# EAGLE design eco-pulser (EAGLE 9.4.1)
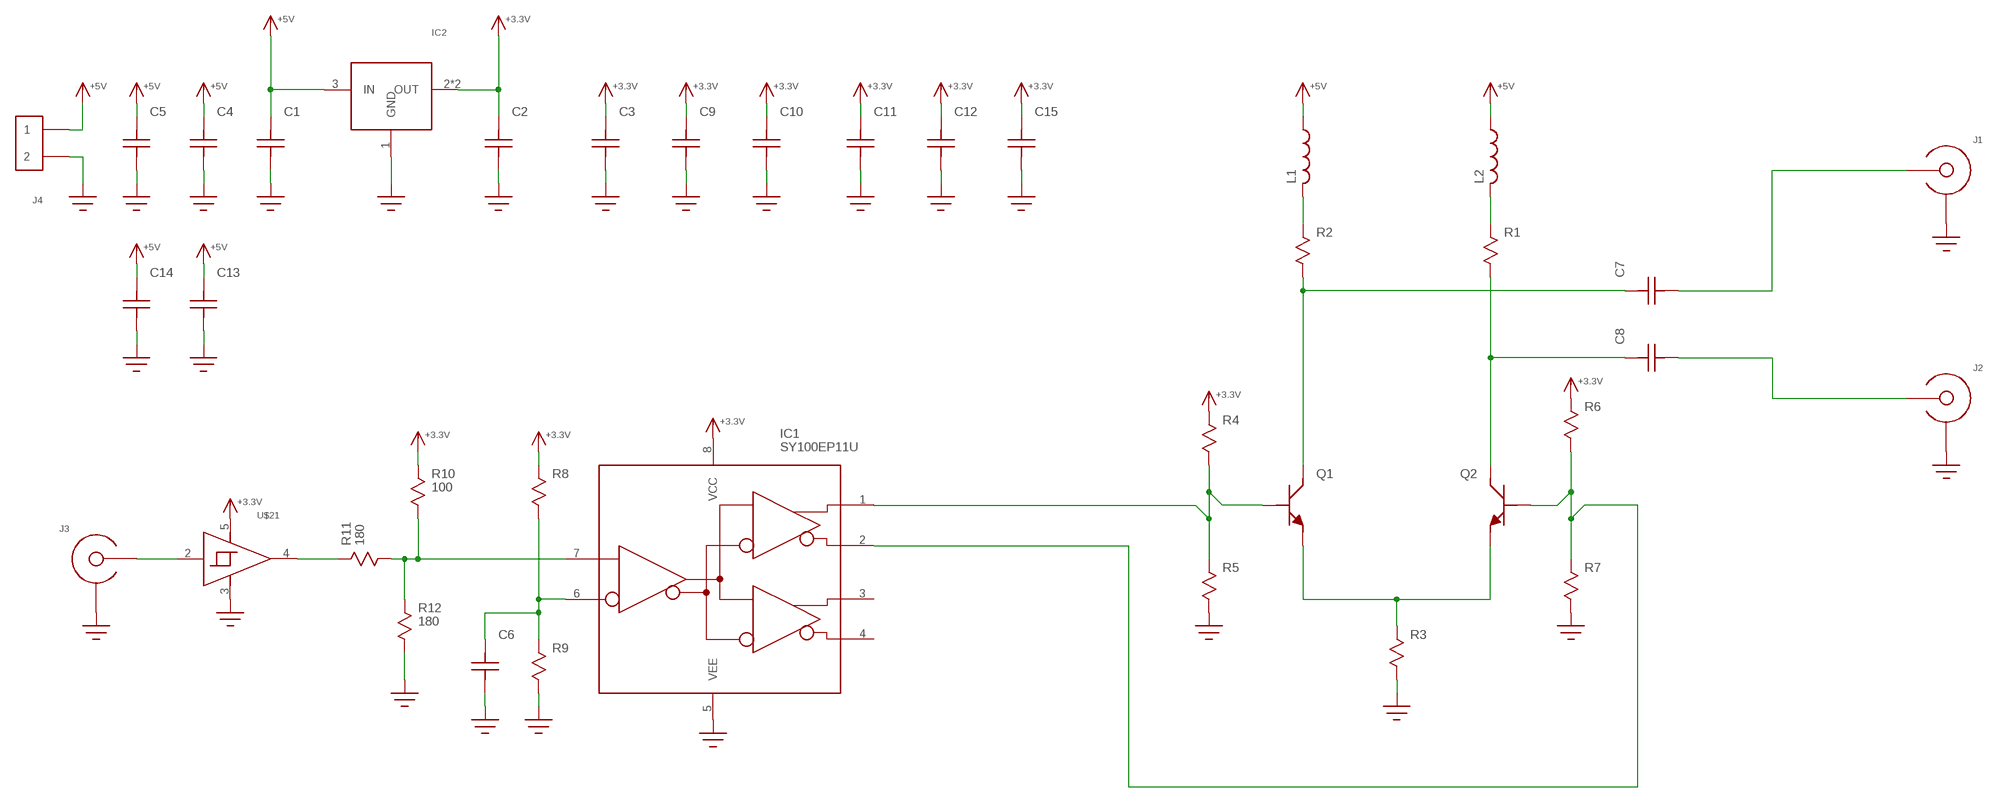
[diagram p0: schematic, sheet 1]

## Parts
C1  C1206  [1206]
C2  C1206  [1206]
C3  C0603  [C0603]
C4  C0603  [C0603]
C5  C0603  [C0603]
C6  C0603  [C0603]
C7  C0603  [C0603]
C8  C0603  [C0603]
C9  C0603  [C0603]
C10  C0603  [C0603]
C11  C0603  [C0603]
C12  C0603  [C0603]
C13  C0603  [C0603]
C14  C0603  [C0603]
C15  C0603  [C0603]
IC1  SY100EP11U  SY10EP11U  [SOIC8]
IC2  AZ1117E  [SOT-223]
J1  SMA_END_LAUNCH4L  [SMA_EDGE_LAUNCH]
J2  SMA_END_LAUNCH4L  [SMA_EDGE_LAUNCH]
J3  SMA_END_LAUNCH4L  [SMA_EDGE_LAUNCH]
J4  HEADER_2PIN  [HEADER_2PIN]
L1  INDUCTOR  [R0603]
L2  INDUCTOR  [R0603]
Q1  NPN-BFP740  [SOT343]
Q2  NPN-BFP740  [SOT343]
R1  R0603  [R0603]
R2  R0603  [R0603]
R3  R0603  [R0603]
R4  R0603  [R0603]
R5  R0603  [R0603]
R6  R0603  [R0603]
R7  R0603  [R0603]
R8  R0603  [R0603]
R9  R0603  [R0603]
R10  100  R0603  [R0603]
R11  180  R0603  [R0603]
R12  180  R0603  [R0603]
U$21  74LVC1G17  [SOT23-5]

## Nets
+3.3V: C2.P$2 C3.P$2 C9.P$2 C10.P$2 C11.P$2 C12.P$2 C15.P$2 IC1.8(VCC) IC2.2(OUT) IC2.4(OUT) R4.P$1 R6.P$1 R8.P$1 R10.P$1 U$21.5(VCC)
+5V: C1.P$2 C4.P$2 C5.P$2 C13.P$2 C14.P$2 IC2.3(IN) J4.1 L1.P$1 L2.P$1
GND: C1.P$1 C2.P$1 C3.P$1 C4.P$1 C5.P$1 C6.P$1 C9.P$1 C10.P$1 C11.P$1 C12.P$1 C13.P$1 C14.P$1 C15.P$1 IC1.5(VEE) IC2.1(GND) J1.BOTTOM_PAD(SHIELD) J1.GND@1(SHIELD) J1.GND@2(SHIELD) J1.GND@3(SHIELD) J1.GND@4(SHIELD) J1.GND@5(SHIELD) J1.GND@6(SHIELD) J1.GND@7(SHIELD) J1.GND@8(SHIELD) J1.GND@14(SHIELD) J1.GND@15(SHIELD) J1.GND@16(SHIELD) J1.GND@17(SHIELD) J1.GND_PAD1(SHIELD) J1.GND_PAD2(SHIELD) J2.BOTTOM_PAD(SHIELD) J2.GND@1(SHIELD) J2.GND@2(SHIELD) J2.GND@3(SHIELD) J2.GND@4(SHIELD) J2.GND@5(SHIELD) J2.GND@6(SHIELD) J2.GND@7(SHIELD) J2.GND@8(SHIELD) J2.GND@14(SHIELD) J2.GND@15(SHIELD) J2.GND@16(SHIELD) J2.GND@17(SHIELD) J2.GND_PAD1(SHIELD) J2.GND_PAD2(SHIELD) J3.BOTTOM_PAD(SHIELD) J3.GND@1(SHIELD) J3.GND@2(SHIELD) J3.GND@3(SHIELD) J3.GND@4(SHIELD) J3.GND@5(SHIELD) J3.GND@6(SHIELD) J3.GND@7(SHIELD) J3.GND@8(SHIELD) J3.GND@14(SHIELD) J3.GND@15(SHIELD) J3.GND@16(SHIELD) J3.GND@17(SHIELD) J3.GND_PAD1(SHIELD) J3.GND_PAD2(SHIELD) J4.2 R3.P$2 R5.P$2 R7.P$2 R9.P$2 R12.P$2 U$21.3(GND)
N$1: L1.P$2 R2.P$1
N$2: L2.P$2 R1.P$1
N$3: C7.P$2 Q1.3(C) R2.P$2
N$4: C8.P$2 Q2.3(C) R1.P$2
N$5: Q1.2(E) Q1.4(E) Q2.2(E) Q2.4(E) R3.P$1
N$6: IC1.1(Q0) Q1.1(B) R4.P$2 R5.P$1
N$7: C6.P$2 IC1.6(!D!) R8.P$2 R9.P$1
N$8: IC1.2(!Q0!) Q2.1(B) R6.P$2 R7.P$1
N$9: R11.P$1 U$21.4(OUT)
N$10: IC1.7(D) R10.P$2 R11.P$2 R12.P$1
N$11: J3.CENTER@1(CENTER) J3.CENTER@2(CENTER) U$21.2(IN)
N$12: C7.P$1 J1.CENTER@1(CENTER) J1.CENTER@2(CENTER)
N$13: C8.P$1 J2.CENTER@1(CENTER) J2.CENTER@2(CENTER)
Unconnected: IC1.3(Q1) IC1.4(!Q1!)

## Library data of the parts
C1-C15 = yapo:C
IC1 = yapo:SY10EP11U
IC2 = yapo:AZ1117E
J1-J3 = yapo:SMA_END_LAUNCH
J4 = yapo:HEADER_2PIN
L1 L2 = yapo:INDUCTOR
Q1 Q2 = yapo:NPN
R1-R12 = yapo:R
U$21 = yapo:74LVC1G17

## Board
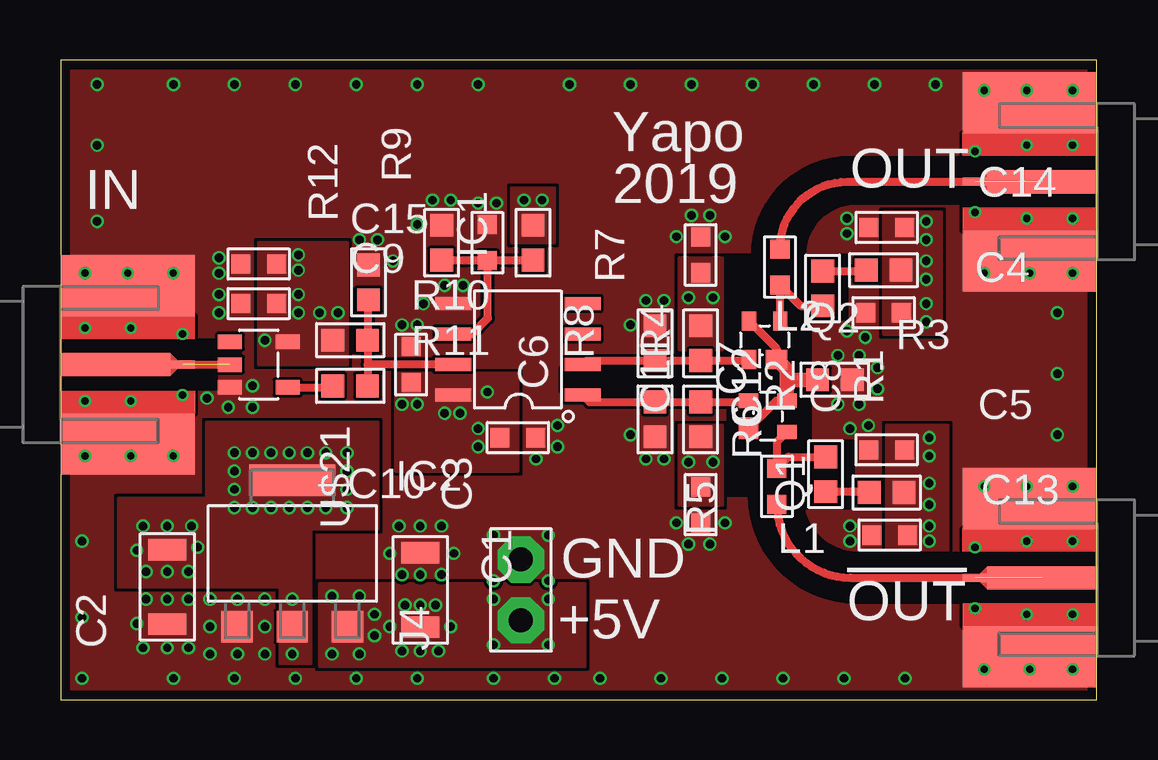
[diagram p1: board, top side]
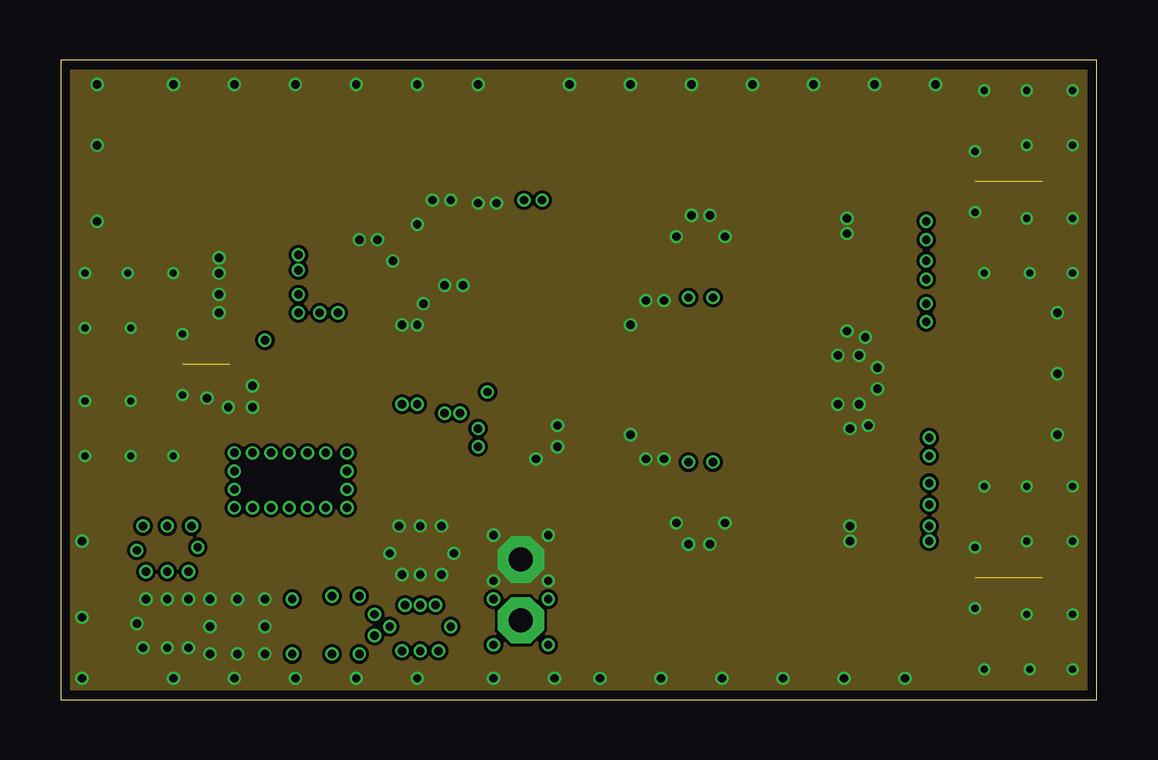
[diagram p2: board, inner layer Route2]
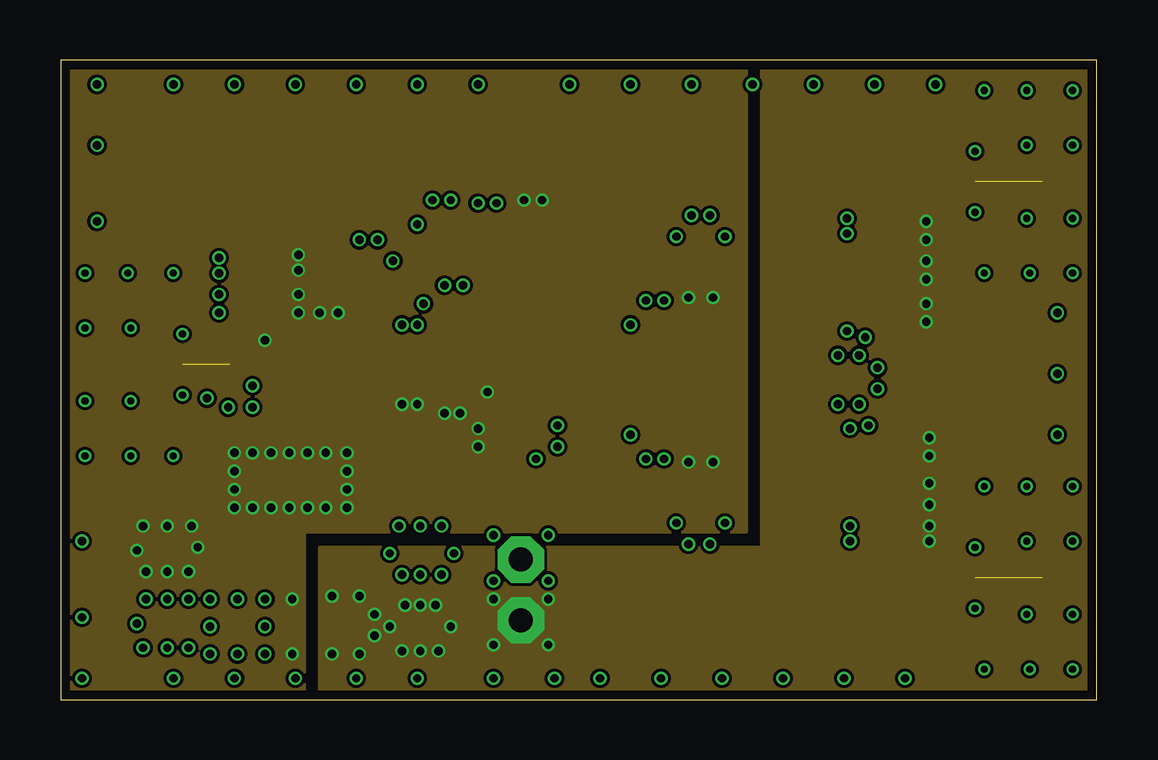
[diagram p3: board, inner layer Route15]
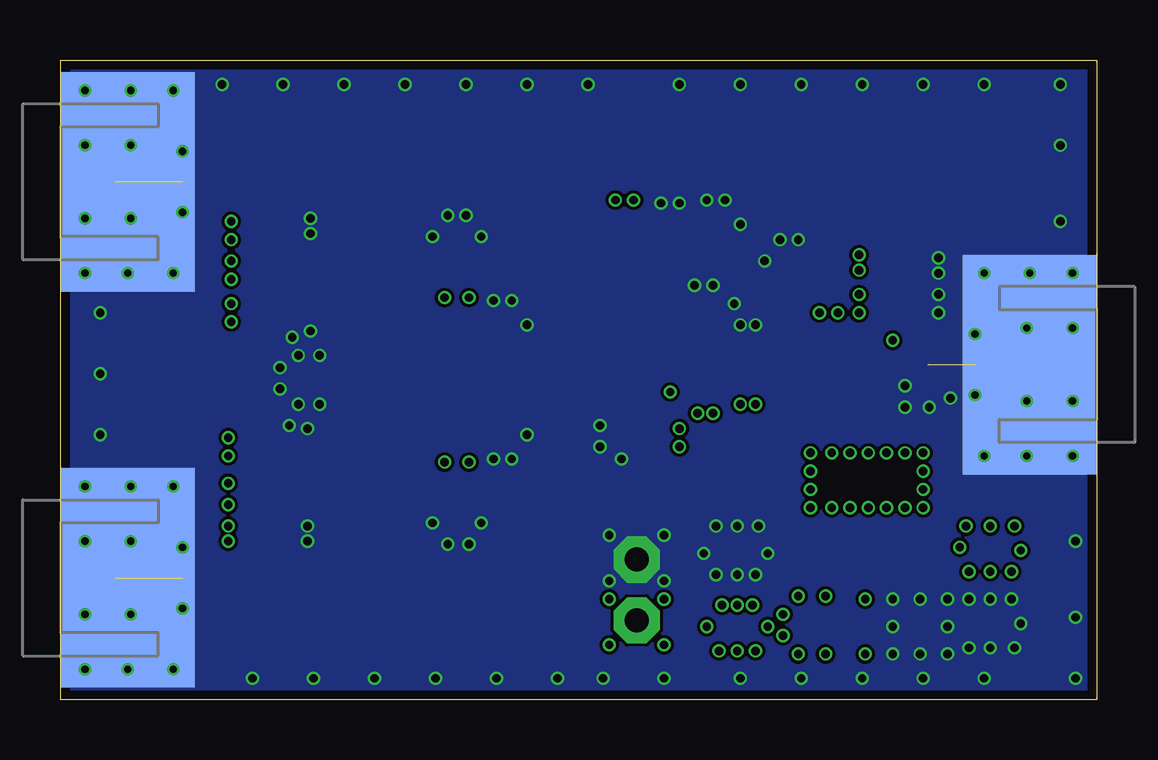
[diagram p4: board, bottom side, seen from below]

Size 43.18 x 26.67 mm. Coordinates in mm from the lower left corner, seen from the top.
Outline: 0,0 43.18,0 43.18,26.67 0,26.67 0,0
Copper layers (1*2*15*16): Top 0.035559375mm / dielectric 0.17018125mm / Route2 0.01778125mm / dielectric 47mil / Route15 0.01778125mm / dielectric 0.17018125mm / Bottom 0.035559375mm
Design rules "oshpark-4layer *": minimum track width 5mil, minimum drill 10mil, track to track 5mil, track to pad 5mil, pad to pad 5mil, via to via 5mil, smd to smd 5mil, copper to edge 15mil, drill to drill 6mil, minimum pad ring 4mil, minimum via ring 4mil, stop-mask expansion 2.5mil, vias tented up to drill 20mil, thermal gap 10mil
tRestrict: area 28.8,18.5 to 38,22.6; area 28.7,4.1 to 38,8.5; area 20.8,8.5 to 31.2,18.5; area 31.1,15.9 to 32.8,18.5; area 31.1,8 to 33,10.8

### Footprints (pad centres in the part's own frame; a part is rotated, then mirrored left to right if it is on the bottom)
1206 = smd 0.9 x 1.6: P$1 -1.55,0; P$2 1.55,0
C0603 = smd 0.8 x 0.8: P$1 -0.75,0; P$2 0.75,0
SOIC8 = smd 0.55 x 1.5: 1 -1.905,-2.7; 2 -0.635,-2.7; 3 0.635,-2.7; 4 1.905,-2.7; 5 1.905,2.7; 6 0.635,2.7; 7 -0.635,2.7; 8 -1.905,2.7
SOT-223 = smd 1.3 x 1.3: 1 -2.3,-3.05; 2 0,-3.05; 3 2.3,-3.05 | smd 3.6 x 1.3: 4 0,3.05
SMA_EDGE_LAUNCH = smd 5.588 x 9.144 bottom: BOTTOM_PAD 2.794,0 | smd 4.572 x 0.965: CENTER@1 2.286,0 | smd 1.016 x 0.33: CENTER@2 5.08,0 | drill 0.3: GND@1 1.016,3.81; GND@2 4.699,3.81; GND@3 1.016,1.524; GND@4 5.08,1.27; GND@5 1.016,-1.524; GND@6 5.08,-1.27; GND@7 1.016,-3.81; GND@8 4.699,-3.81; GND@14 2.794,3.81; GND@15 2.921,-3.81; GND@16 2.921,-1.524; GND@17 2.921,1.524 | smd 5.588 x 2.54: GND_PAD1 2.794,3.302; GND_PAD2 2.794,-3.302
HEADER_2PIN = drill 1 pad 1.93 octagon: 1 -1.27,0; 2 1.27,0
R0603 = smd 0.95 x 0.95: P$1 -0.725,0; P$2 0.725,0
SOT343 = smd 0.6 x 0.8: 1 -0.65,-0.8; 3 0.65,0.8; 4 -0.65,0.8 | smd 0.9 x 0.8: 2 0.5,-0.8
SOT23-5 = smd 0.6 x 1: 1 -0.95,-1.2; 2 0,-1.2; 3 0.95,-1.2; 4 0.95,1.2; 5 -0.95,1.2

### Placement (x,y rotation side)
C1  14.99,4.57 270 top
C2  4.45,4.7 90 top
C3  14.61,13.97 270 top
C4  34.29,16.13 0 top
C5  34.42,10.41 0 top
C6  17.78,19.05 270 top
C7  29.84,8.89 90 top
C8  29.97,18.03 270 top
C9  8.26,16.51 0 top
C10  19.05,10.92 180 top
C11  26.67,8.13 90 top
C12  26.67,18.54 270 top
C13  34.54,6.86 0 top
C14  34.42,19.68 0 top
C15  8.26,18.16 0 top
IC1  19.05,14.61 90 top
IC2  9.65,6.1 0 top
J1  43.18,5.08 180 top
J2  43.18,21.59 180 top
J3  0,13.97 0 top
J4  19.18,4.57 90 top
L1  34.42,8.64 180 top
L2  34.29,17.91 180 top
Q1  29.46,11.81 270 top
Q2  29.34,14.99 0 top
R1  31.75,17.14 270 top
R2  31.88,9.4 90 top
R3  32.26,13.34 0 top
R4  26.67,11.68 90 top
R5  24.77,11.68 270 top
R6  26.67,14.86 270 top
R7  24.77,14.86 90 top
R8  19.68,19.05 270 top
R9  15.88,19.05 90 top
R10  12.06,14.99 0 top
R11  12.06,13.08 0 top
R12  12.83,17.4 90 top
U$21  8.26,13.97 270 top

### Tracks (layer width: path | path; a pad name or v marks a point on that pad's centre or on a via)
+3.3V  (via drill 0.35)
  other vias: 19.3,20.83 9.91,16.89 9.91,16.13 11.56,16.13 9.91,18.54 9.91,17.91 8.51,14.99 14.22,12.32 14.86,12.32 17.78,12.83 17.4,11.3 17.4,10.54 16,11.94 16.64,11.94 26.16,16.76 27.18,16.76 26.16,9.91 27.18,9.91 3.43,7.24 4.45,7.24 5.46,7.24 4.45,5.33 3.56,5.33 5.33,5.33 5.71,6.35 3.17,6.22 8,8 8.76,8 9.53,8 10.29,8 11.05,8 8,10.29 8.76,10.29 9.53,10.29 10.29,10.29 11.05,10.29 11.94,10.29 7.24,10.29 7.24,9.53 7.24,8.76 7.24,8 11.94,8 11.94,8.76 11.94,9.53 9.65,4.19 9.65,1.91 20.07,20.83 10.79,16.13
  pour Top (no thermals): 8.26,19.05 8.26,13.97 11.94,13.97 11.94,19.05
  pour Top (no thermals): 13.97,13.59 13.97,9.53 19.05,9.53 19.05,13.59
  pour Top (no thermals): 25.78,14.61 27.56,14.61 27.56,18.41 25.78,18.41
  pour Top (no thermals): 25.78,11.43 27.56,11.43 27.56,8.13 25.78,8.13
  pour Route15 (no thermals): 0,0 10.16,0 10.16,6.99 28.57,6.99 28.57,26.67 0,26.67
  pour Top (no thermals): 10.41,1.52 10.41,7.11 13.21,7.11 13.21,11.56 6.1,11.56 6.1,8.38 2.41,8.38 2.41,4.7 9.14,4.7 9.14,1.52
  pour Top (no thermals): 18.8,19.05 20.57,19.05 20.57,21.34 18.8,21.34
+5V  (via drill 0.35)
  other vias: 36.07,18.29 36.07,17.53 36.07,16.51 36.07,15.75 36.2,10.92 36.2,10.16 36.2,9.02 36.2,8.13 36.07,19.18 36.07,19.94 36.2,7.24 36.2,6.6 20.32,4.19 18.03,4.19 18.03,2.29 20.32,2.29 14.35,3.94 14.99,3.94 15.62,3.94 14.99,2.03 14.22,2.03 15.75,2.03 16.26,3.05 13.72,3.05 11.3,1.91 11.3,4.32 13.08,3.56 13.08,2.67 12.45,1.91 12.45,4.32
  pour Top (no thermals): 34.29,20.32 34.29,15.24 36.7,15.24 36.7,20.32
  pour Top (no thermals): 34.42,11.43 34.42,6.22 36.96,6.22 36.96,11.43
  pour Route15 (no thermals): 10.79,6.35 10.79,0 43.18,0 43.18,26.67 29.21,26.67 29.21,6.35
  pour Top (no thermals): 10.79,4.83 21.84,4.83 21.84,1.4 10.79,1.4
GND  (via drill 0.35)
  other vias: 6.99,12.19 8,13.08 6.1,12.57 6.6,16.13 6.6,17.78 6.6,16.89 14.86,19.81 15.49,20.83 16.26,20.83 17.4,20.7 18.16,20.7 20.7,11.43 20.7,10.54 19.81,10.03 14.22,15.62 14.86,15.62 16,17.27 16.76,17.27 15.11,16.51 25.15,16.64 24.38,16.64 23.75,15.62 23.75,11.05 24.38,10.03 25.15,10.03 25.65,19.3 27.69,19.3 25.65,7.37 27.69,7.37 33.53,15.11 34.04,13.84 34.04,12.95 33.66,11.43 32.38,12.32 33.27,12.32 32.38,14.35 33.27,14.35 32.77,15.37 32.89,11.3 32.77,20.07 32.77,19.43 32.89,7.24 32.89,6.6 14.1,7.24 14.99,7.24 15.88,7.24 14.22,5.21 14.99,5.21 15.88,5.21 16.38,6.1 13.72,6.1 18.03,4.95 20.32,4.95 20.32,6.86 18.03,6.86 8.51,3.05 6.22,3.05 6.22,4.19 7.37,4.19 8.51,4.19 6.22,1.91 7.37,1.91 8.51,1.91 4.45,4.19 5.33,4.19 3.56,4.19 4.45,2.16 5.33,2.16 3.43,2.16 3.17,3.17 26.16,6.48 27.05,6.48 26.29,20.19 27.05,20.19 0.89,0.89 22.48,0.89 25.02,0.89 27.56,0.89 30.1,0.89 32.64,0.89 35.18,0.89 41.53,11.05 41.53,13.59 41.53,16.13 36.45,25.65 33.91,25.65 31.37,25.65 28.83,25.65 26.29,25.65 23.75,25.65 21.21,25.65 17.4,25.65 14.86,25.65 12.32,25.65 9.78,25.65 7.24,25.65 4.7,25.65 1.52,25.65 1.52,23.11 1.52,19.94 4.7,0.89 7.24,0.89 9.78,0.89 12.32,0.89 14.86,0.89 18.03,0.89 20.57,0.89 0.89,3.43 0.89,6.6 12.45,19.18 13.21,19.18 13.84,18.29 6.6,18.41 8,12.19
  pour Top (rank 2, no thermals): 0,0 43.18,0 43.18,26.67 0,26.67
  pour Bottom (no thermals): 0,0 43.18,0 43.18,26.67 0,26.67
  pour Route2 (no thermals): 0,0 43.18,0 43.18,26.67 0,26.67
  cutout Top (no thermals): 4.45,14.99 4.45,12.95 6.48,12.95 6.48,14.99
N$1
  Top 0.33: R2.P$1 33.66,8.67 L1.P$2
N$2
  Top 0.33: R1.P$1 33.53,17.87 L2.P$2
N$3
  Top 0.33: Q1.3 29.84,10.74 C7.P$2 30.33,10.12 R2.P$2
N$4
  Top 0.33: Q2.3 arc-90 29.97,15.8 C8.P$2 30.84,16.42 R1.P$2
N$5
  Top 0.33: Q2.4 29.84,14.64 Q2.2 | Q1.2 29.81,12.46 Q1.4
  Top 0.61: Q2.2 30.26,13.76 30.26,13.34 | 30.26,13.34 Q1.4 | R3.P$1 30.26,13.34
N$6
  Top 0.33: IC1.1 22.04,12.41 R5.P$1 R4.P$2 28.61,12.41 Q1.1
N$7
  Top 0.33: IC1.6 17.14,15.24 17.8,15.9 17.8,18.32 | R9.P$1 15.9,18.3 C6.P$2 17.8,18.32 | 17.8,18.32 R8.P$2
N$8
  Top 0.33: IC1.2 21.91,14.13 R7.P$1 R6.P$2 28.64,14.13 Q2.1
N$9
  Top 0.33: U$21.4 11.34,13.02 R11.P$1
N$10
  Top 0.33: 12.79,13.97 R10.P$2 12.79,16.67 R12.P$1 | 12.79,13.97 R11.P$2 | IC1.7 12.79,13.97
N$11  (1 unrouted)
  Top 0.33: J3.CENTER@1 U$21.2
N$12  (1 unrouted)
  Top 0.33: C7.P$1 arc90 32.91,5.08 J1.CENTER@1
N$13  (1 unrouted)
  Top 0.33: C8.P$1 arc-90 32.78,21.59 J2.CENTER@1

### Text on the board
tPlace: Yapo | 2019 | OUT | IN | GND | +5V | !OUT!